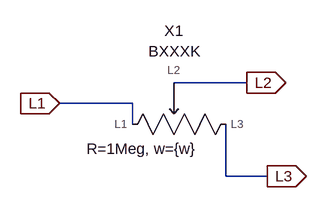
[diagram p0: schematic B1000K.asc]
B1000K.asc, the LTspice schematic file:
Version 4
SHEET 1 880 680
WIRE 288 128 176 128
WIRE 112 160 0 160
WIRE 112 192 112 160
WIRE 256 272 256 192
WIRE 320 272 256 272
FLAG 0 160 L1
IOPIN 0 160 In
FLAG 288 128 L2
IOPIN 288 128 Out
FLAG 320 272 L3
IOPIN 320 272 Out
SYMBOL Base_BxxxK 176 144 R0
WINDOW 39 -49 86 Center 2
SYMATTR SpiceLine R=1Meg, w={w}
SYMATTR InstName X1
SYMATTR Description May be used for modeling linear potentiometers. Parameters: R, x. By default, R = 100 ohms and x is undefined. x must be within the range of [0, 1]. At x = 0, there will be no output signal.

The netlist it stands for:
* B1000K.asc
XX1 L1 L2 L3 BXXXK R=1Meg, w={w}  ; pins L1 L2 L3
.backanno
.end